# EAGLE design Gadget-Box-ESP8266-Modules (EAGLE 6.6.0)

## Sheet 1 of 2
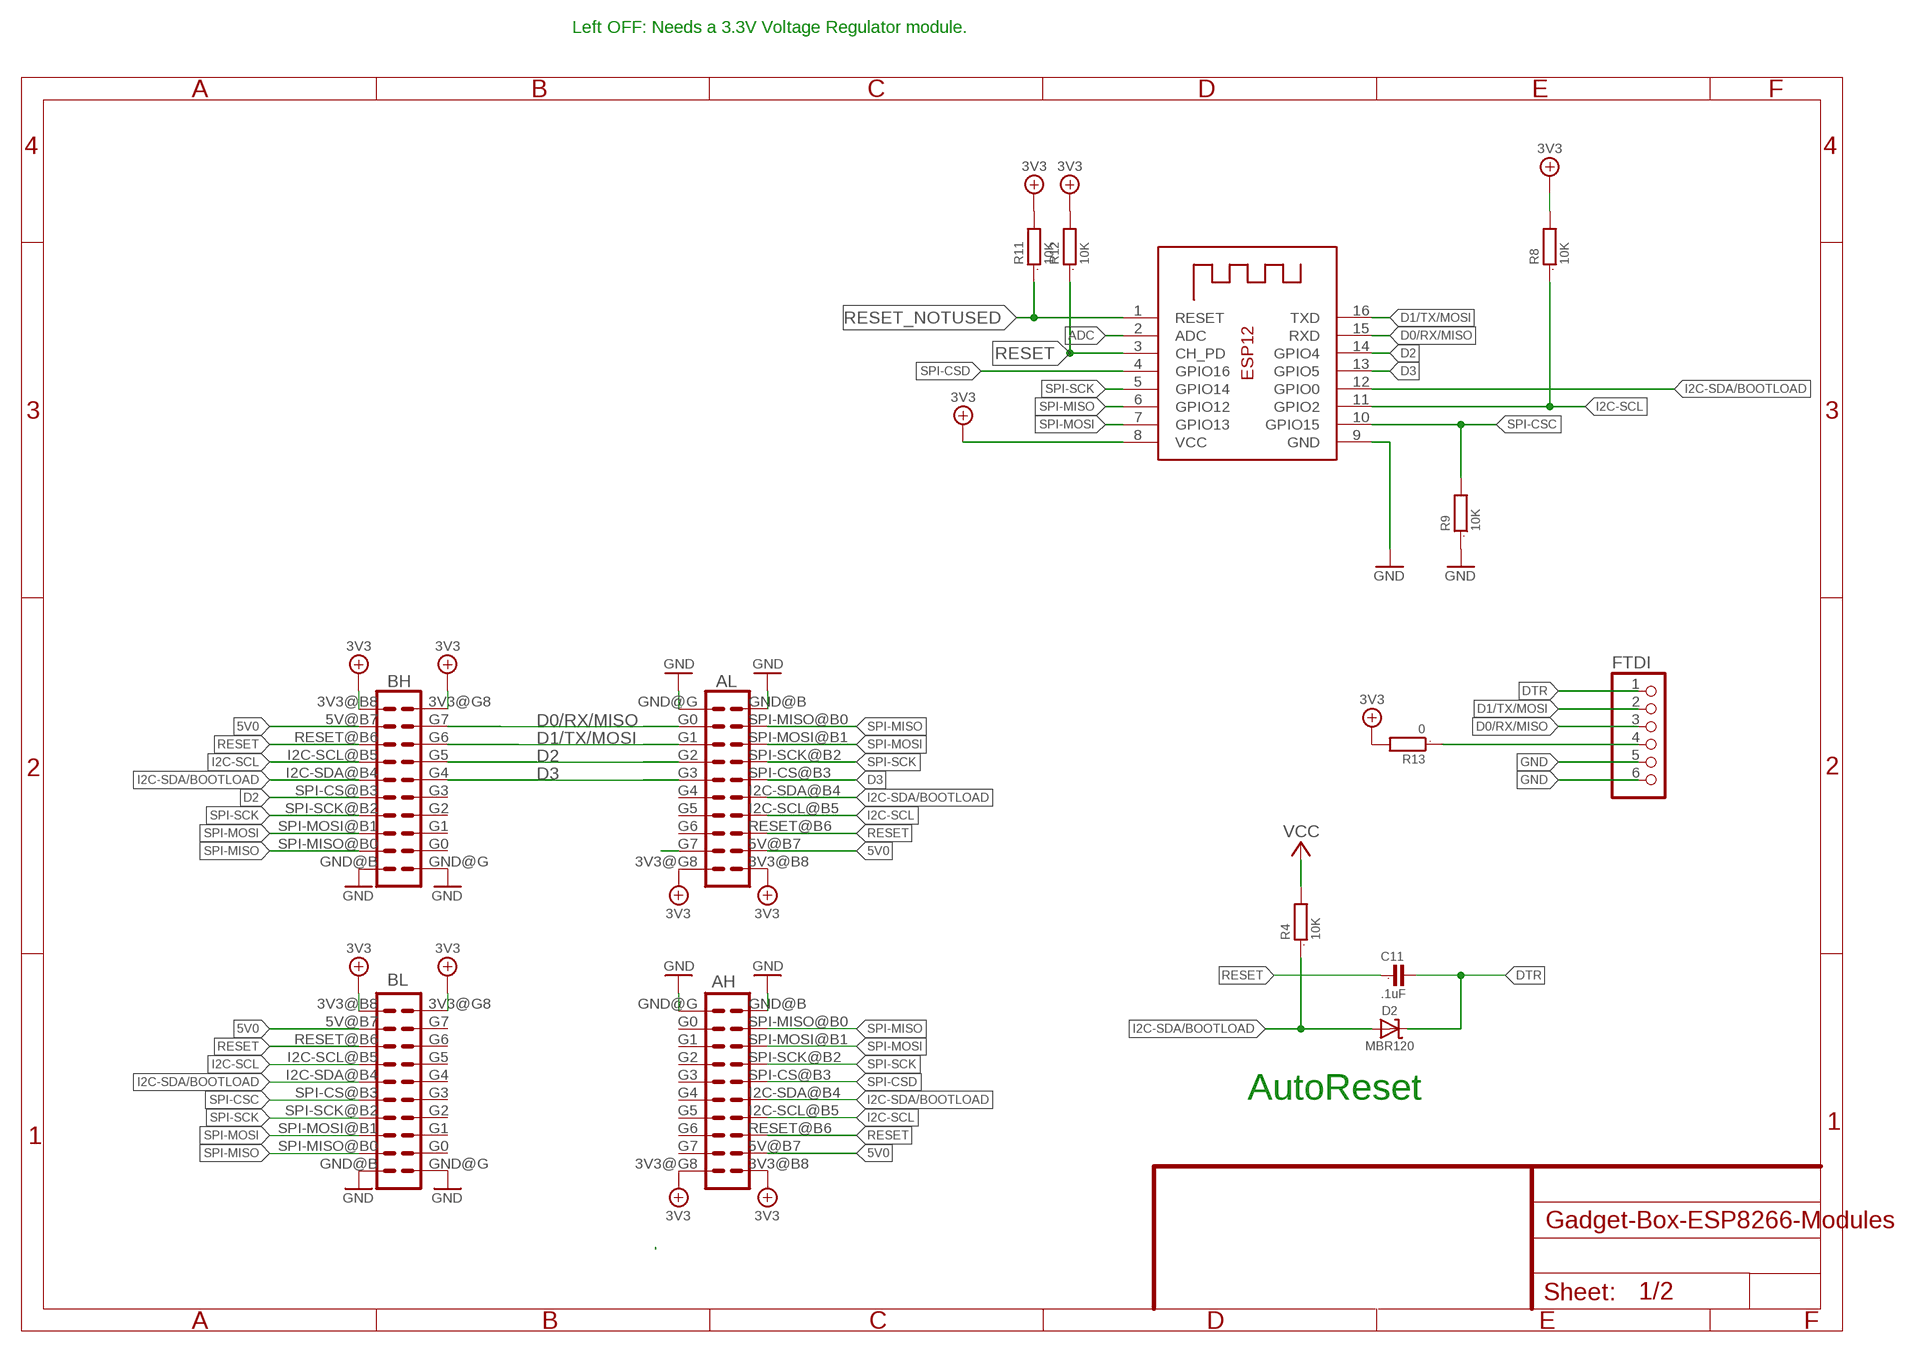
[diagram p0: schematic, sheet 1]

### Parts
AH  ECOGECOG_SLOT  [ECOG]
AL  ECOGECOG_SLOT  [ECOG]
BH  ECOGECOG_SLOT  [ECOG]
BL  ECOGECOG_SLOT  [ECOG]
C11  .1uF  C0805  [0805]
D2  MBR120  DIODE-SCHOTTKYSOD-123  [SOD-123]
FTDI  PINHD-1X6  [1X06]
R4  10K  R0805  [0805]
R8  10K  R0805  [0805]
R9  10K  R0805  [0805]
R11  10K  R0805  [0805]
R12  10K  R0805  [0805]
R13  0  R0805  [0805]
X2  ESP-12  [ESP-12]

### Nets
3V3: AH.3V3@B8(3V3) AH.3V3@G8(3V3) AL.3V3@B8(3V3) AL.3V3@G8(3V3) BH.3V3@B8(3V3) BH.3V3@G8(3V3) BL.3V3@B8(3V3) BL.3V3@G8(3V3) R8.2 R11.2 R12.2 R13.2 X2.8(VCC) ; also sheet 2
5V0: AH.5V@B7(5V) AL.5V@B7(5V) BH.5V@B7(5V) BL.5V@B7(5V)
ADC: X2.2(ADC) ; also sheet 2
D0/RX/MISO: AL.G0 BH.G7 FTDI.3 X2.15(RXD)
D1/TX/MOSI: AL.G1 BH.G6 FTDI.2 X2.16(TXD)
D2: AL.G2 BH.G5 BH.SPI-CS@B3(SPI-CS) X2.14(GPIO4)
D3: AL.G3 AL.SPI-CS@B3(SPI-CS) BH.G4 X2.13(GPIO5)
DTR: C11.2 D2.C FTDI.1
GND [gnd]: AH.GND@B(GND) AH.GND@G(GND) AL.GND@B(GND) AL.GND@G(GND) BH.GND@B(GND) BH.GND@G(GND) BL.GND@B(GND) BL.GND@G(GND) FTDI.5 FTDI.6 R9.1 X2.9(GND) ; also sheet 2
I2C-SCL: AH.I2C-SCL@B5(I2C-SCL) AL.I2C-SCL@B5(I2C-SCL) BH.I2C-SCL@B5(I2C-SCL) BL.I2C-SCL@B5(I2C-SCL) R8.1 X2.11(GPIO2)
I2C-SDA/BOOTLOAD: AH.I2C-SDA@B4(I2C-SDA) AL.I2C-SDA@B4(I2C-SDA) BH.I2C-SDA@B4(I2C-SDA) BL.I2C-SDA@B4(I2C-SDA) D2.A R4.1 X2.12(GPIO0)
N$5: AL.G7
N$6: FTDI.4 R13.1
RESET: AH.RESET@B6(RESET) AL.RESET@B6(RESET) BH.RESET@B6(RESET) BL.RESET@B6(RESET) C11.1 R12.1 X2.3(CH_PD)
RESET_NOTUSED: R11.1 X2.1(RESET)
SPI-CSC: BL.SPI-CS@B3(SPI-CS) R9.2 X2.10(GPIO15)
SPI-CSD: AH.SPI-CS@B3(SPI-CS) X2.4(GPIO16)
SPI-MISO: AH.SPI-MISO@B0(SPI-MISO) AL.SPI-MISO@B0(SPI-MISO) BH.SPI-MISO@B0(SPI-MISO) BL.SPI-MISO@B0(SPI-MISO) X2.6(GPIO12)
SPI-MOSI: AH.SPI-MOSI@B1(SPI-MOSI) AL.SPI-MOSI@B1(SPI-MOSI) BH.SPI-MOSI@B1(SPI-MOSI) BL.SPI-MOSI@B1(SPI-MOSI) X2.7(GPIO13)
SPI-SCK: AH.SPI-SCK@B2(SPI-SCK) AL.SPI-SCK@B2(SPI-SCK) BH.SPI-SCK@B2(SPI-SCK) BL.SPI-SCK@B2(SPI-SCK) X2.5(GPIO14)
VCC: R4.2
Unconnected: AH.G0 AH.G1 AH.G2 AH.G3 AH.G4 AH.G5 AH.G6 AH.G7 AL.G4 AL.G5 AL.G6 BH.G0 BH.G1 BH.G2 BH.G3 BL.G0 BL.G1 BL.G2 BL.G3 BL.G4 BL.G5 BL.G6 BL.G7

### Notes on the sheet
- Left OFF: Needs a 3.3V Voltage Regulator module.
- AutoReset

## Sheet 2 of 2
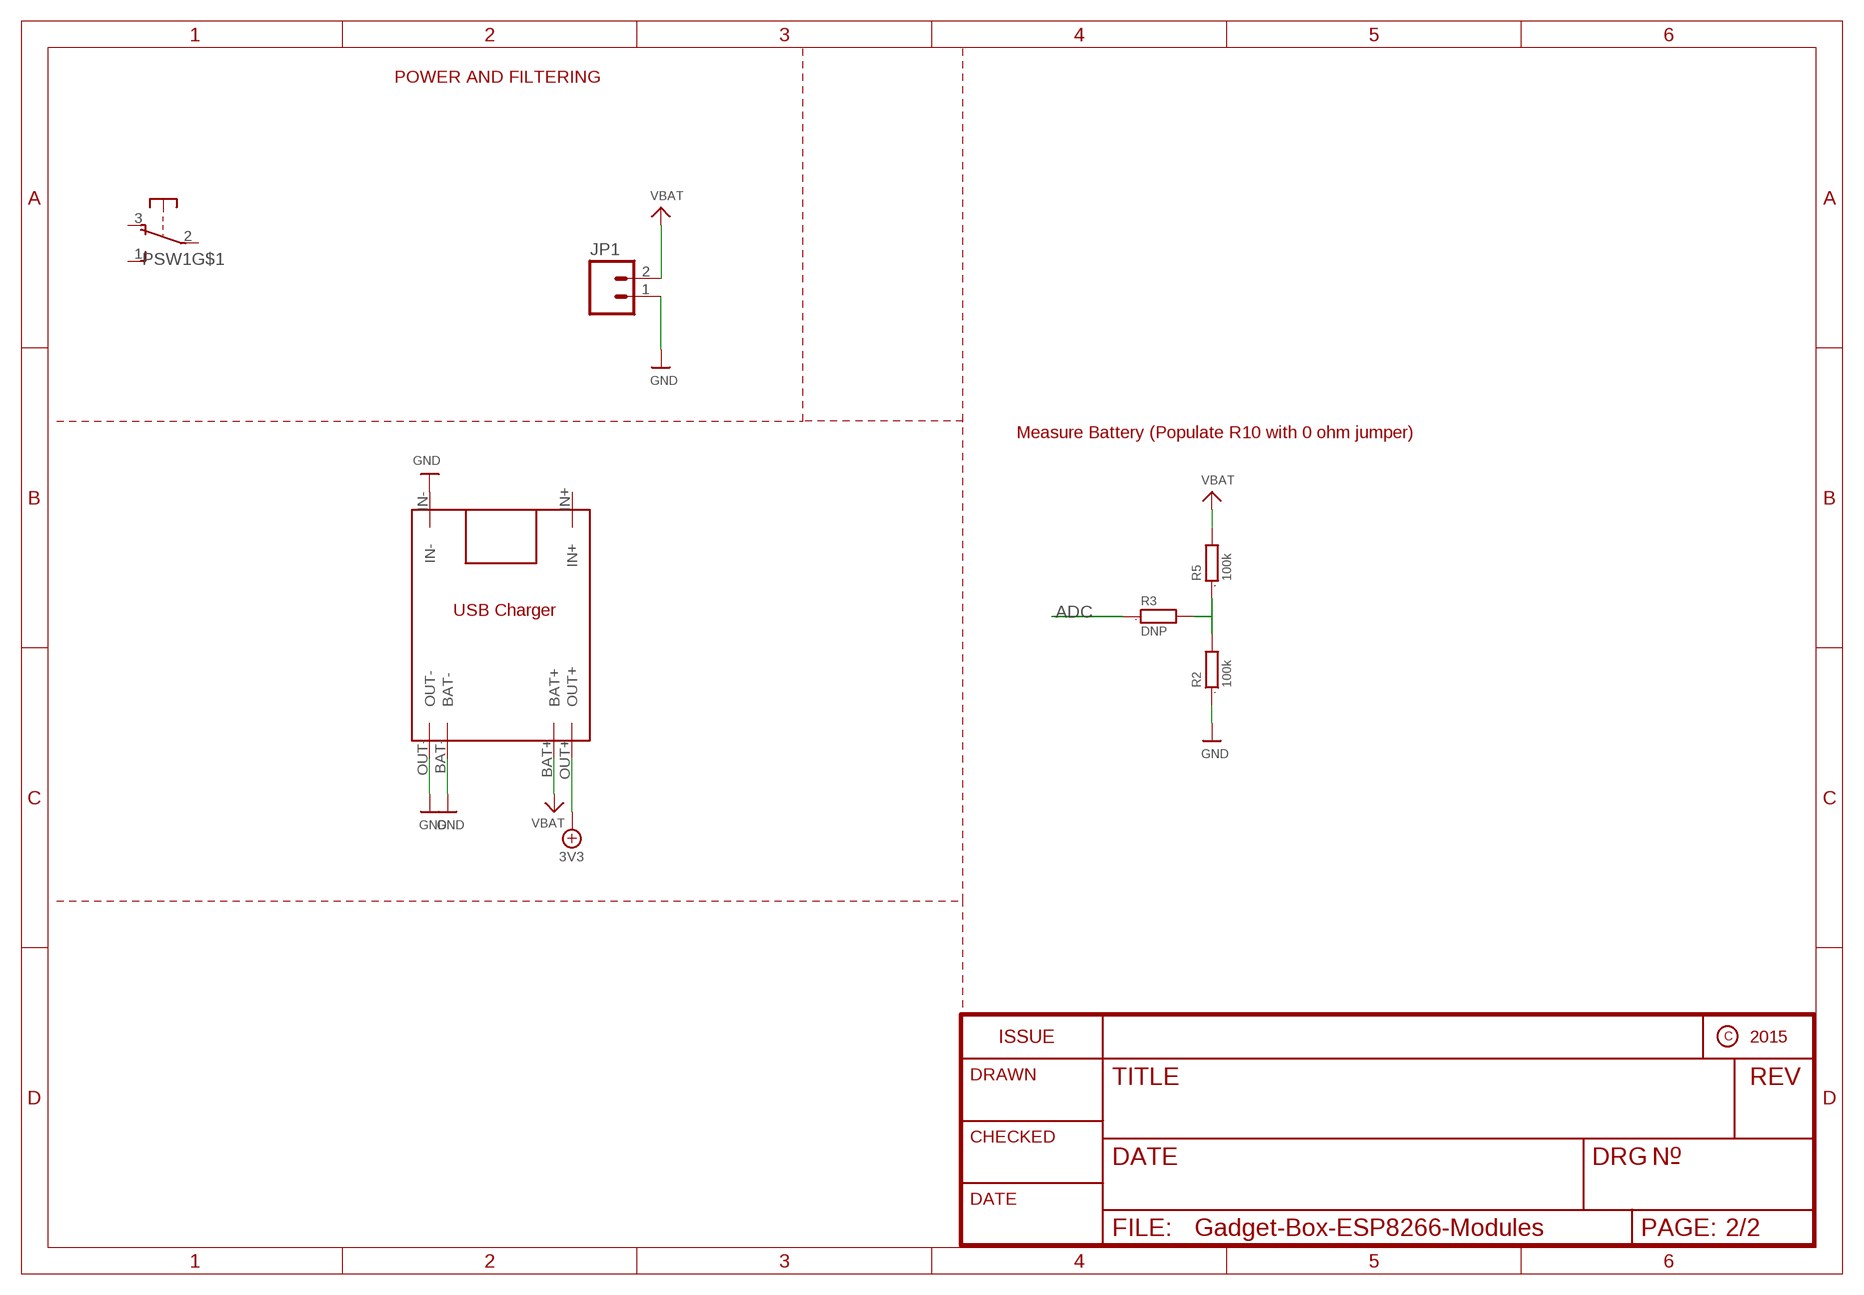
[diagram p1: schematic, sheet 2]

### Parts
JP1  M02-JST-2-PTH-NO_SILK  [JST-2-PTH-NS]
PSW1  OS102011MA1Q  [OS102011MA1Q]
R2  100k  R0603  [0603]
R3  DNP  R0603  [0603]
R5  100k  R0603  [0603]
U$1  TP4056  [TP4056]

### Nets
3V3: U$1.OUT+ ; also sheet 1
ADC: R3.1 ; also sheet 1
GND [gnd]: JP1.1 R2.1 U$1.BAT- U$1.IN- U$1.OUT- ; also sheet 1
N$2: R2.2 R3.2 R5.1
VBAT: JP1.2 R5.2 U$1.BAT+
Unconnected: PSW1.1(S) PSW1.2(P) PSW1.3(O) PSW1.MT1(MT) PSW1.MT2(MT) U$1.IN+

### Notes on the sheet
- POWER AND FILTERING
- Measure Battery (Populate R10 with 0 ohm jumper)

## Library data of the parts
AH AL BH BL = eCogs:ECOG; PARTNO: PPPC102LFBN-RC,SULLINS CONNECTOR SOLUTIONS,dk,S6106-ND,"CONN HEADER FEM 20POS.1"" DL GOLD", REF67
C11 = GadgetFactory:C: CAPACITOR, European symbol; PARTNO: GRM21BR71E104KA01L,MURATA ELECTRONICS (VA),DK,490-1673-1-ND,CAP CER .1UF 25V 10% X7R 0805, REF3
D2 = microbuilder:DIODE-SCHOTTKY; PARTNO: MBR120VLSFT3G,on semiconductor,dk,MBR120VLSFT3GOSCT-ND ,DIODE SCHOTTKY 20V 1A SOD123FL , REF71
FTDI = GadgetFactory:PINHD-1X6: PIN HEADER; PARTNO: PPPC061LGBN-RC,SULLINS CONNECTOR SOLUTIONS,dk,S5481-ND ,"6 Position Header Connector 0.100"" (2.54mm) Through Hole - Right Angle Gold ", REF91
JP1 = SparkFun:M02: Header 2 Standard 2-pin 0.1" header. Use with straight break away headers (SKU : PRT-00116), right angle break away headers (PRT-00553), swiss pins (PRT-00743), machine pins (PRT-00117), and female headers (PRT-00115). Molex polarized connector foot print use with SKU : PRT-08233 with associated crimp pins and housings.; PARTNO: B2B-PH-SM4-TB(LF)(SN),JST SALES AMERICA INC (VA),dk,455-1734-1-ND ,"2 Positions Header, Shrouded Connector 0.079 (2.00mm) Through Hole Tin ", REF87
PSW1 = adafruit:OS102011MA1Q: OS10201MA1Q through-hole right angle switch http://www.ladyada.net/library/eagle; PARTNO: OS102011MA1QN1,C&K Components,dk,CKN9559-ND,SWITCH SLIDE SPDT 100MA 12V , REF72
R2 R5 = GadgetFactory:R: RESISTOR, European symbol; PARTNO: RC0603JR-07100KL,YAGEO (VA),dk,311-100KGRCT-ND,RES SMD 100K OHM 5% 1/10W 0603 , REF76
R3 R13 = GadgetFactory:R: RESISTOR, European symbol; BOM: EXCLUDE
R4 = GadgetFactory:R: RESISTOR, European symbol; PARTNO: RC0805JR-0710KL,YAGEO (VA),dk,311-10KARCT-ND,RES SMD 10K OHM 5% 1/8W 0805, REF63
R8 R9 R11 R12 = GadgetFactory:R: RESISTOR, European symbol; DIGIKEY: RMCF0805JT10K0CT-ND; PARTNO: RC0805JR-0710KL,YAGEO (VA),dk,311-10KARCT-ND,RES SMD 10K OHM 5% 1/8W 0805, REF63
U$1 = TP4056 charging module:TP4056
X2 = adafruit:ESP-12; ADAFRUIT: 2491; PARTNO: 385646,AI-Thinker,dx.com,385646,ESP8266 Serial Wi-Fi Wireless Transceiver Module - http://www.dx.com/p/esp-12e-esp8266-serial-wi-fi-wireless-transceiver-module-for-arduino-rpi-built-in-antenna-385646, REF94

## Net classes
2 gnd: width 0.254 mm, drill 0.381 mm, clearance 0.254 mm
3 usbvcc: width 0.254 mm, drill 0.381 mm, clearance 0.254 mm
4 aref: width 0.254 mm, drill 0.381 mm, clearance 0.254 mm

## Board
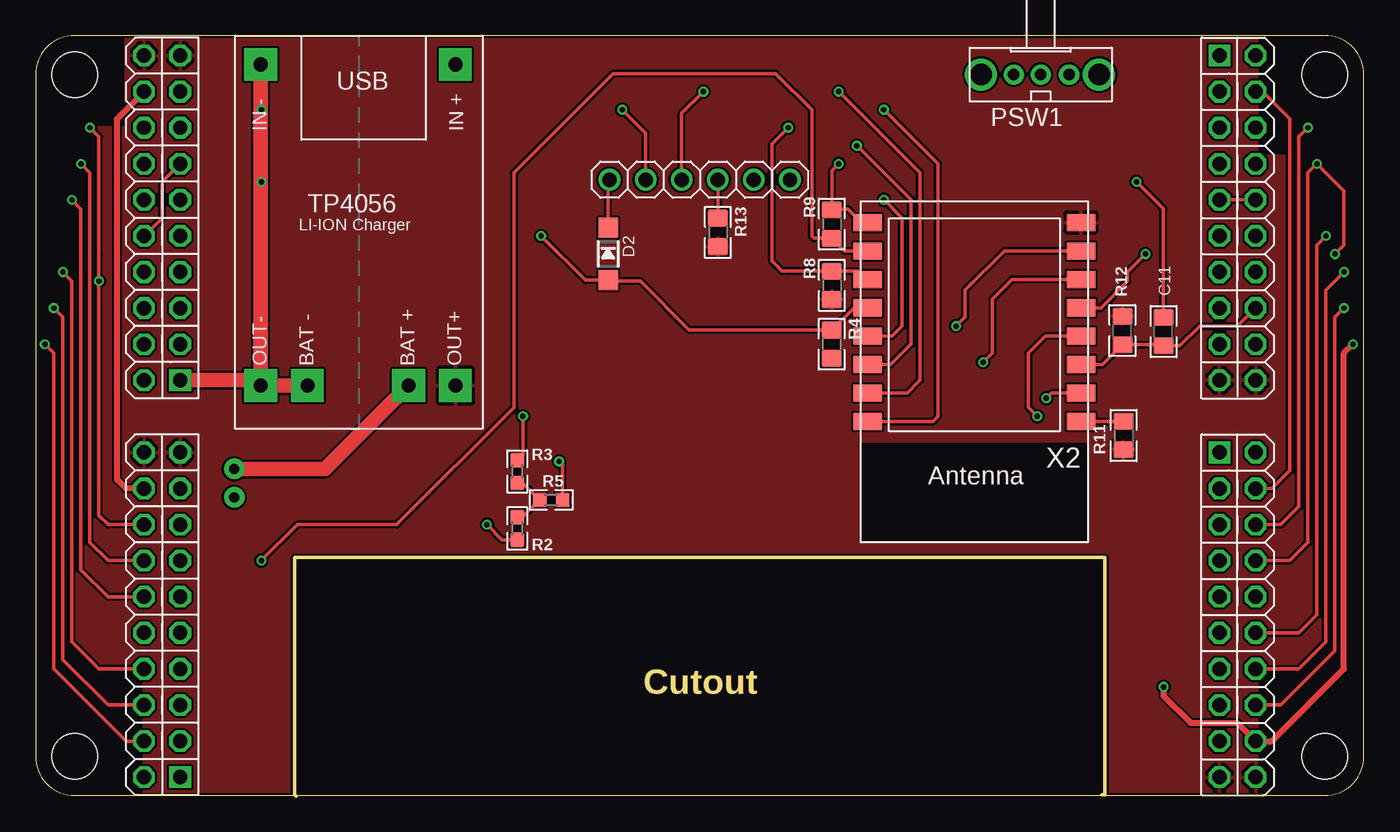
[diagram p2: board, top side]
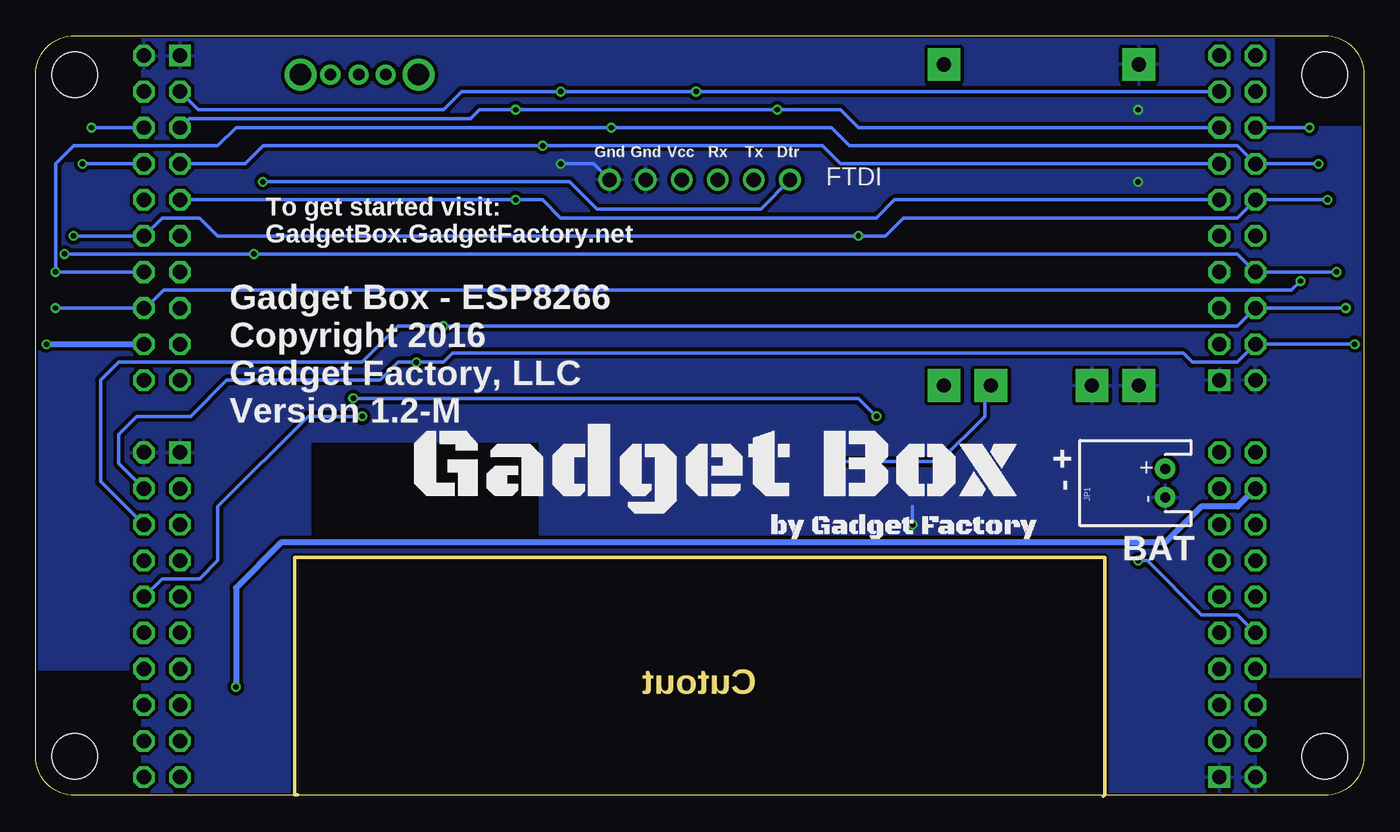
[diagram p3: board, bottom side, seen from below]

Size 93.5 x 53.55 mm. Coordinates in mm from the lower left corner, seen from the top.
Outline: 18.35,0 18.25,0.1 18.25,16.8 75.25,16.8 75.25,0.1 75.05,0.1
Copper layers (1*16): Top 0.035mm / dielectric 1.5mm / Bottom 0.035mm
Design rules "hackvana *": minimum track width 6mil, minimum drill 0.3mm, track to track 6mil, track to pad 6mil, pad to pad 6mil, via to via 6mil, smd to smd 0mil, copper to edge 6mil, drill to drill 6mil, minimum pad ring 10mil, minimum via ring 6mil, stop-mask expansion 2mil, vias tented up to drill 100mil, thermal gap 10mil

### Footprints (pad centres in the part's own frame; a part is rotated, then mirrored left to right if it is on the bottom)
ECOG93P53P5 = hole 3.2: 4,4; 92,4; 92,52; 4,52
ECOG = drill 1.016 octagon: 3V3@B8 21.59,3.81; 3V3@G8 21.59,1.27; 5V@B7 19.05,3.81; G0 1.27,1.27; G1 3.81,1.27; G2 6.35,1.27; G3 8.89,1.27; G4 11.43,1.27; G5 13.97,1.27; G6 16.51,1.27; G7 19.05,1.27; GND@B -1.27,3.81; I2C-SCL@B5 13.97,3.81; I2C-SDA@B4 11.43,3.81; RESET@B6 16.51,3.81; SPI-CS@B3 8.89,3.81; SPI-MISO@B0 1.27,3.81; SPI-MOSI@B1 3.81,3.81; SPI-SCK@B2 6.35,3.81 | drill 1.016 square: GND@G -1.27,1.27
0805 = smd 1.2 x 1.4: 1 -1,0; 2 1,0
SOD-123 = smd 1.4 x 1.4: A 1.85,0; C -1.85,0
1X06 = drill 1.016: 1 -6.35,0; 2 -3.81,0; 3 -1.27,0; 4 1.27,0; 5 3.81,0; 6 6.35,0
JST-2-PTH-NS = drill 0.7 pad 1.448: 1 -1,0; 2 1,0
OS102011MA1Q = drill 0.8 pad 1.422: 1 -2,0; 2 0,0; 3 1.9,0 | drill 1.5 pad 2.184: MT1 -4.1,0; MT2 4.2,0
0603 = smd 1 x 1: 1 -0.8,0; 2 0.8,0
TP4056 = drill 1 pad 2.3 square: BAT+ 3.505,-8.89; BAT- -3.607,-8.89; IN+ 6.807,13.716; IN- -6.909,13.716; OUT+ 6.807,-8.89; OUT- -6.909,-8.89
ESP-12 = smd 2 x 1.2: 1 -7.5,4.5; 2 -7.5,2.5; 3 -7.5,0.5; 4 -7.5,-1.5; 5 -7.5,-3.5; 6 -7.5,-5.5; 7 -7.5,-7.5; 8 -7.5,-9.5; 9 7.5,-9.5; 10 7.5,-7.5; 11 7.5,-5.5; 12 7.5,-3.5; 13 7.5,-1.5; 14 7.5,0.5; 15 7.5,2.5; 16 7.5,4.5

### Placement (x,y rotation side)
$$U$1  [ECOG93P53P5]  -1.25,-1.2 0 top
AH  82.06,22.93 270 top
AL  82.06,50.87 270 top
BH  11.45,30.55 90 top
BL  11.45,2.61 90 top
C11  79.39,32.71 90 top
D2  40.31,38.17 270 top
FTDI  46.75,43.4 0 top
JP1  13.99,22.04 90 bottom
PSW1  70.75,50.8 180 top
R2  33.91,18.85 90 top
R3  33.91,22.85 270 top
R4  56.02,31.82 270 top
R5  36.29,20.85 0 top
R8  56.05,35.96 270 top
R9  56.05,40.28 270 top
R11  76.58,25.39 270 top
R12  76.49,32.78 90 top
R13  48.03,39.69 270 top
U$1  22.75,37.8 0 top
U$100  [GADGETBOX_TEXT]  45.57,22.84 0 bottom
X2  66.08,30.88 180 top

### Tracks (layer width: path | path; a pad name or v marks a point on that pad's centre or on a via)
3V3
  pour Top: -1.25,8.42 -1.25,47.08 6.37,47.08 6.37,54.68 85.95,54.68 85.95,45.06 94.92,45.06 94.92,8.42 85.95,8.42 85.95,-1.2 7.64,-1.2 7.64,8.42
5V0  (via drill 0.38)
  Top 0.406: v92.73,31.82 92.09,31.18 92.09,8.96 87.02,3.88 AH.5V@B7 84.6,5.15 81.3,5.15 79.39,7.06 v79.39,7.69 | BL.5V@B7 6.37,21.66 5.74,22.3 5.74,47.7 BH.5V@B7
  Bottom 0.406: v92.73,31.82 AL.5V@B7 | BL.5V@B7 8.91,20.39 11.45,20.39 13.99,17.85 76.22,17.85 79.39,14.68 v79.39,7.69
ADC  (via drill 0.38)
  Top 0.254: X2.2 71.51,28.38 v71.14,28.01 | v34.31,26.74 34.31,24.05 R3.1
  Bottom 0.254: v71.14,28.01 35.58,28.01 v34.31,26.74
D0/RX/MISO  (via drill 0.38)
  Top 0.254: X2.15 61.35,28.38 62.25,29.28 62.25,43.88 v56.53,49.6 | FTDI.3 45.48,48.07 v47.01,49.6
  Bottom 0.254: BH.G7 v47.01,49.6 48.28,49.6 v56.53,49.6 63.52,49.6 64.79,48.33 82.06,48.33 AL.G0
D1/TX/MOSI  (via drill 0.38)
  Top 0.254: X2.16 63.16,26.38 63.52,26.74 63.52,44.52 v59.71,48.33 | FTDI.2 42.94,46.68 v41.3,48.33
  Bottom 0.254: BH.G6 35.58,47.06 36.85,48.33 40.02,48.33 v41.3,48.33 v59.71,48.33 62.25,48.33 62.89,47.7 82.7,47.7 AL.G1
D2  (via drill 0.38)
  Top 0.254: X2.14 60.17,30.38 61.62,31.82 61.62,41.98 v57.8,45.79 | BH.SPI-CS@B3 8.91,40.71 8.91,43.25 BH.G5
  Bottom 0.254: BH.G5 36.85,44.52 38.12,45.79 56.53,45.79 v57.8,45.79 77.49,45.79 78.76,44.52 AL.G2
D3  (via drill 0.38)
  Top 0.254: X2.13 60.27,32.38 60.98,33.09 60.98,40.71 v59.71,41.98 | AL.G3 AL.SPI-CS@B3
  Bottom 0.254: BH.G4 33.04,41.98 34.31,40.71 56.53,40.71 57.8,41.98 v59.71,41.98 61.62,41.98 AL.G3
DTR  (via drill 0.38)
  Top 0.254: C11.2 79.39,41.35 v77.49,43.25 | D2.C 40.31,43.31 FTDI.1
  Bottom 0.254: v77.49,43.25 55.9,43.25 53.99,41.34 42.45,41.34 FTDI.1
GND  (via drill 0.38)
  Top 0.254: X2.9 58.13,40.38 57.17,41.34 56.11,41.34 R9.1 56.05,44.03 v56.53,44.52 | R2.1 32.84,18.05 v31.77,19.12
  Top 1.016: U$1.OUT- U$1.IN- | U$1.OUT- U$1.BAT- | BH.GND@G 15.47,29.28 U$1.OUT-
  Bottom 0.254: v56.53,44.52 54.22,44.52 FTDI.6 | v31.77,19.12 31.77,20.39
  other vias: 15.89,43.25 15.89,48.33
  pour Bottom: -1.25,8.45 -1.25,47.06 6.37,47.06 6.37,55.19 85.95,55.19 85.95,44.52 94.92,44.52 94.92,8.96 85.95,8.96 85.95,-1.71 7.64,-1.71 7.64,8.45
I2C-SCL  (via drill 0.38)
  Top 0.254: AH.I2C-SCL@B5 88.92,8.96 90.83,10.87 90.83,35.63 v92.09,36.9 | BL.I2C-SCL@B5 5.1,16.58 3.83,17.85 3.83,43.88 v3.2,44.52 | v52.98,47.06 51.84,45.92 51.84,37.66 52.54,36.96 R8.1 58,36.96 X2.11
  Bottom 0.254: AL.I2C-SCL@B5 v92.09,36.9 92.09,44.52 90.83,45.79 80.67,45.79 79.39,47.06 v52.98,47.06 37.48,47.06 36.22,45.79 8.91,45.79 BH.I2C-SCL@B5 v3.2,44.52
I2C-SDA/BOOTLOAD  (via drill 0.38)
  Top 0.254: AH.I2C-SDA@B4 88.92,11.5 90.19,12.77 90.19,38.8 v90.83,39.44 | BL.I2C-SDA@B4 5.1,14.04 3.2,15.95 3.2,41.34 v2.56,41.98 | X2.12 57.59,34.38 R4.1 46.01,32.82 42.56,36.27 40.37,36.27 D2.A 38.7,36.32 v35.58,39.44
  Bottom 0.254: v2.56,41.98 BH.I2C-SDA@B4 8.91,40.71 32.41,40.71 33.67,39.44 34.95,39.44 v35.58,39.44 80.67,39.44 81.94,40.71 84.6,40.71 AL.I2C-SDA@B4 v90.83,39.44
N$2
  Top 0.254: R2.2 34.29,19.65 R5.1 34.29,22.05 R3.2
N$6
  Top 0.254: FTDI.4 R13.1
RESET  (via drill 0.38)
  Top 0.254: AH.RESET@B6 87.65,6.42 91.46,10.23 91.46,33.72 v92.09,34.36 | X2.3 75.09,30.38 R12.1 79.32,31.79 C11.1 80.55,31.71 81.94,33.09 84.6,33.09 AL.RESET@B6 | BL.RESET@B6 5.1,19.12 4.46,19.75 v4.46,36.27 4.46,38.17 4.46,46.42 v3.83,47.06
  Bottom 0.254: v92.09,34.36 AL.RESET@B6 85.75,34.36 84.47,35.63 5.1,35.63 v4.46,36.27 | v3.83,47.06 BH.RESET@B6
RESET_NOTUSED
  Top 0.254: X2.1 76.57,26.38 R11.1
SPI-CSC  (via drill 0.38)
  Top 0.254: X2.10 56.95,38.38 R9.2 54.79,39.28 54.63,39.44 54.63,48.33 52.09,50.87 40.66,50.87 33.67,43.88 33.67,27.38 25.42,19.12 18.43,19.12 v15.89,16.58
  Bottom 0.254: v15.89,16.58 15.26,16.58 11.45,12.77 8.91,12.77 BL.SPI-CS@B3
SPI-CSD  (via drill 0.38)
  Top 0.254: X2.4 71.06,32.38 69.87,31.18 69.87,27.38 v70.5,26.74
  Bottom 0.254: v70.5,26.74 74.31,26.74 80.67,20.39 80.67,16.58 81.94,15.31 84.6,15.31 AH.SPI-CS@B3
SPI-MISO  (via drill 0.38)
  Top 0.254: AH.SPI-MISO@B0 87.02,21.66 88.28,22.93 88.28,47.7 86.38,49.6 AL.SPI-MISO@B0 | BL.SPI-MISO@B0 6.37,3.88 1.29,8.96 1.29,31.18 v0.66,31.82 | X2.6 68.72,36.38 67.33,34.99 67.33,31.18 v66.69,30.55
  Bottom 0.254: v0.66,31.82 BH.SPI-MISO@B0 8.91,30.55 12.09,30.55 12.72,31.18 64.16,31.18 64.79,30.55 v66.69,30.55 67.97,30.55 69.23,29.28 80.03,29.28 82.57,26.74 86.38,26.74 87.65,25.47 87.65,23.44 AH.SPI-MISO@B0
SPI-MOSI  (via drill 0.38)
  Top 0.254: AH.SPI-MOSI@B1 87.65,19.12 88.92,20.39 88.92,46.42 v89.56,47.06 | BL.SPI-MOSI@B1 5.1,6.42 1.92,9.6 1.92,33.72 v1.29,34.36 | X2.7 68.17,38.38 65.42,35.63 65.42,33.72 v64.79,33.09
  Bottom 0.254: v89.56,47.06 AL.SPI-MOSI@B1 | v1.29,34.36 BH.SPI-MOSI@B1 8.91,33.09 62.89,33.09 v64.79,33.09 67.97,33.09 70.5,30.55 87.65,30.55 88.92,29.28 88.92,22.17 AH.SPI-MOSI@B1
SPI-SCK  (via drill 0.38)
  Top 0.254: AH.SPI-SCK@B2 88.28,16.58 89.56,17.85 89.56,43.88 v90.19,44.52 92.09,42.61 92.09,38.8 v91.46,38.17 | BL.SPI-SCK@B2 4.46,8.96 2.56,10.87 2.56,36.27 v1.92,36.9 | X2.5 74.97,34.38 76.86,36.27 76.86,36.9 v78.12,38.17
  Bottom 0.254: v90.19,44.52 AL.SPI-SCK@B2 | v1.92,36.9 BH.SPI-SCK@B2 8.91,38.17 v78.12,38.17 80.03,38.17 v91.46,38.17
VBAT  (via drill 0.38)
  Top 0.254: R5.2 37.09,23.32 v36.85,23.57
  Top 1.016: JP1.2 20.39,23.04 U$1.BAT+
  Bottom 0.254: v36.85,23.57 29.86,23.57 26.69,26.74 26.69,28.48 U$1.BAT+

### Text on the board
Dimension: Cutout
bPlace: Dtr | Tx | Rx | Vcc | Gnd | Gnd | To get started visit: / GadgetBox.GadgetFactory.net | Gadget Box - ESP8266 / Copyright 2016 / Gadget Factory, LLC / Version 1.2-M | - + | BAT
Reference: TOP Silkscreen is on layer 200